# EAGLE schematic Motormix (EAGLE 9.6.2)
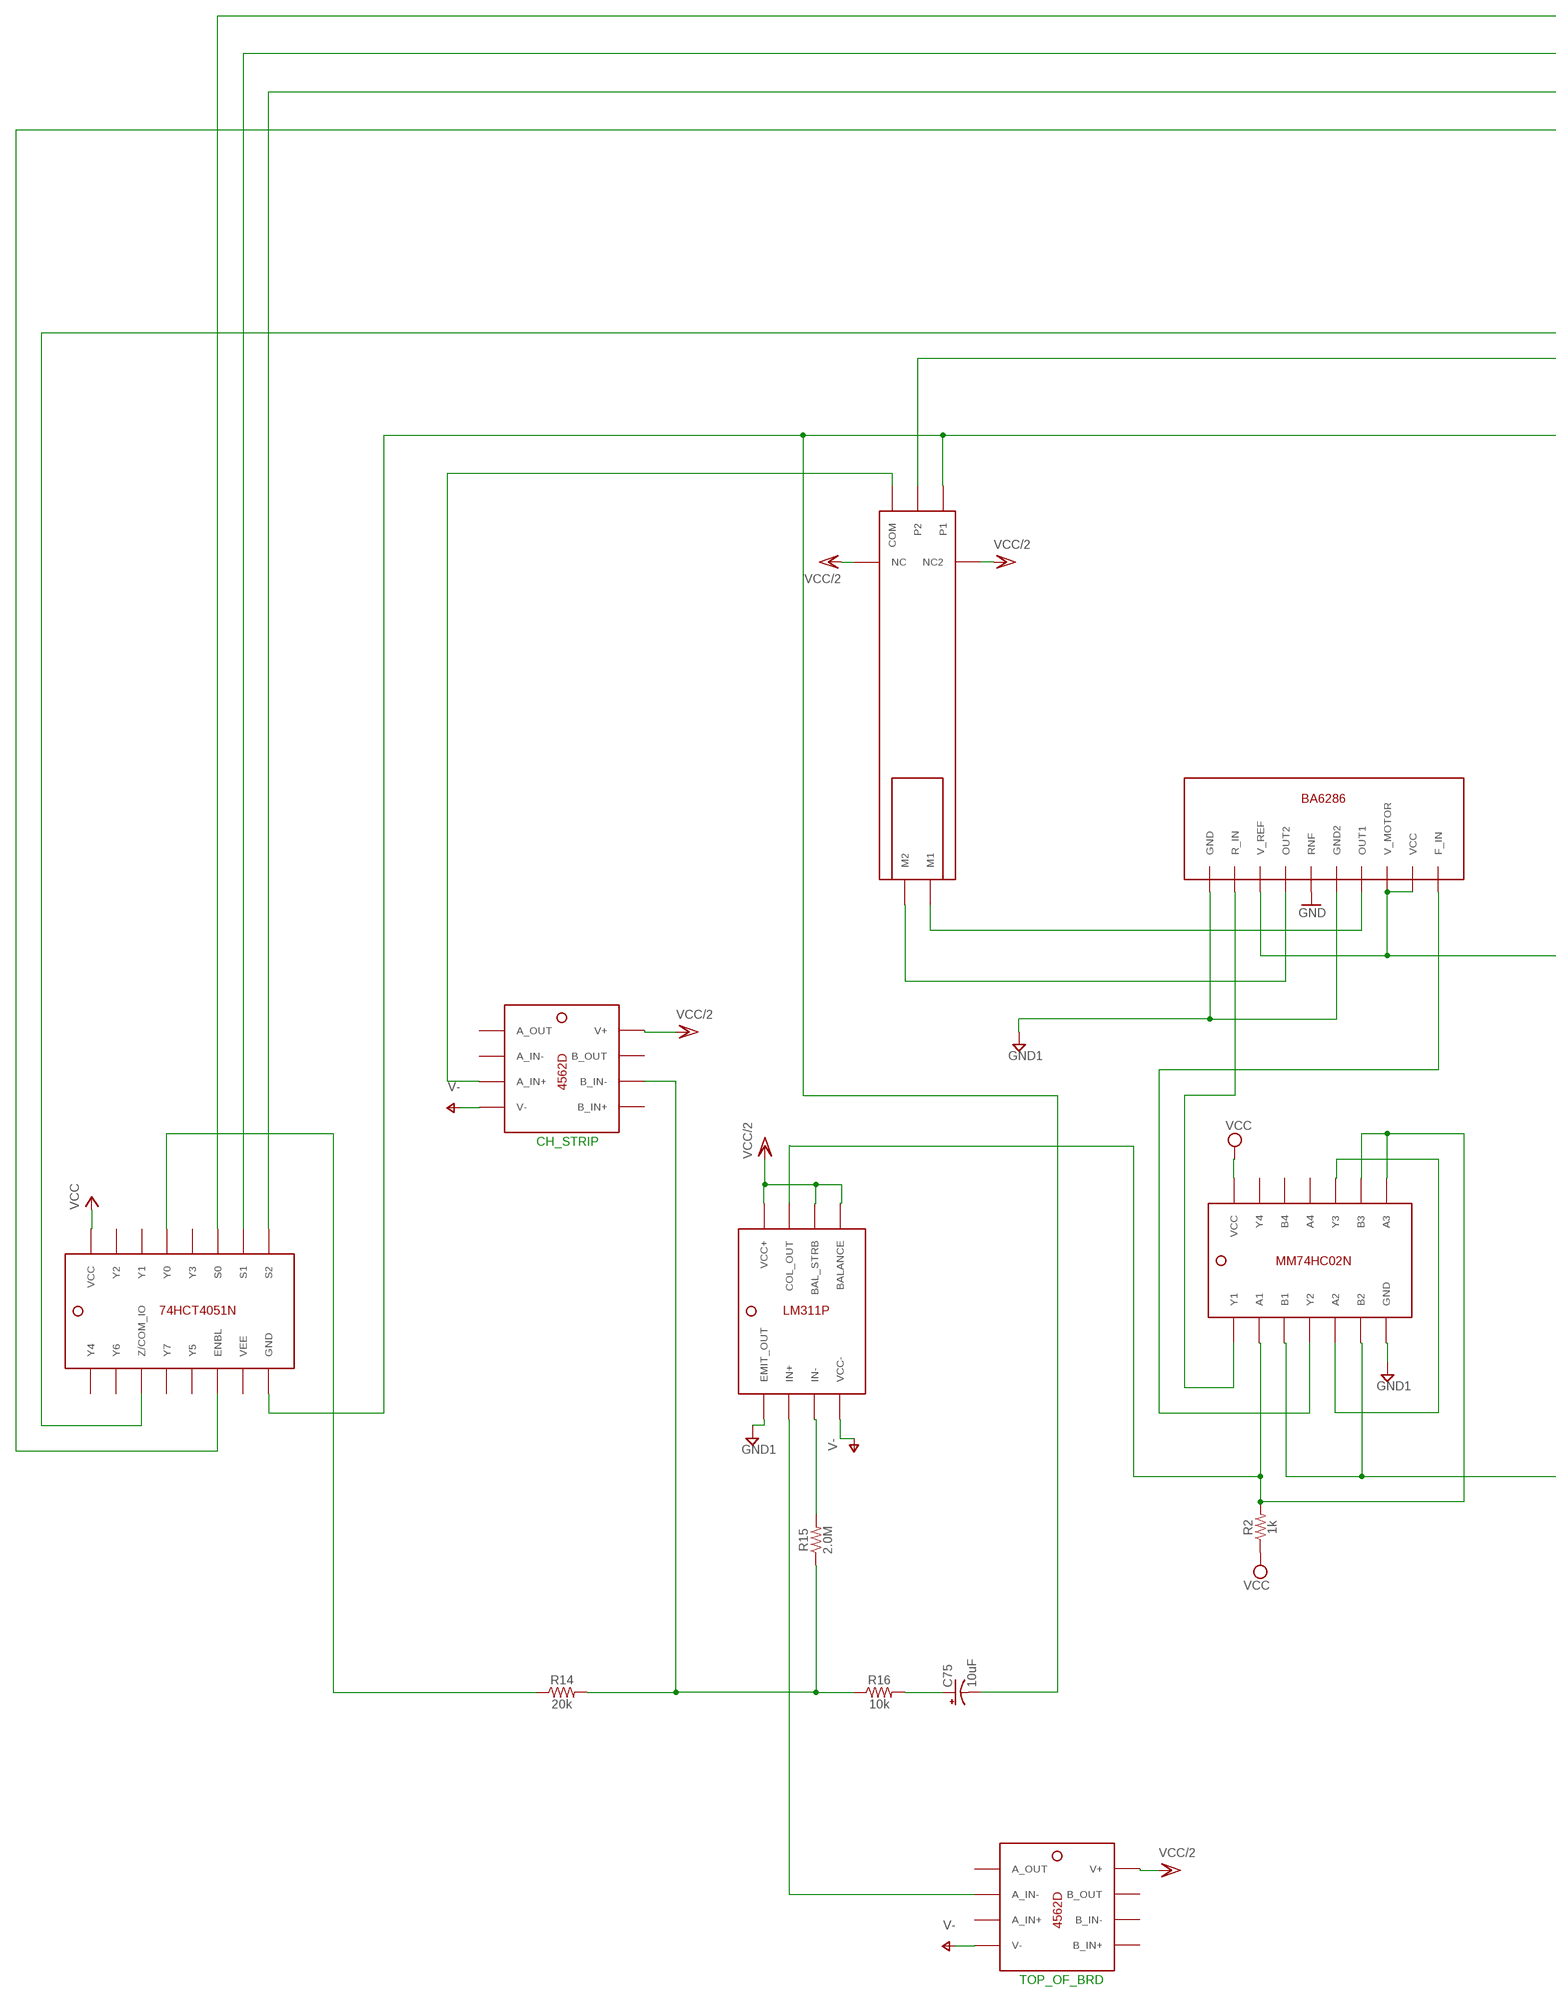
[diagram p0: schematic, sheet 1, part 1 of 2]
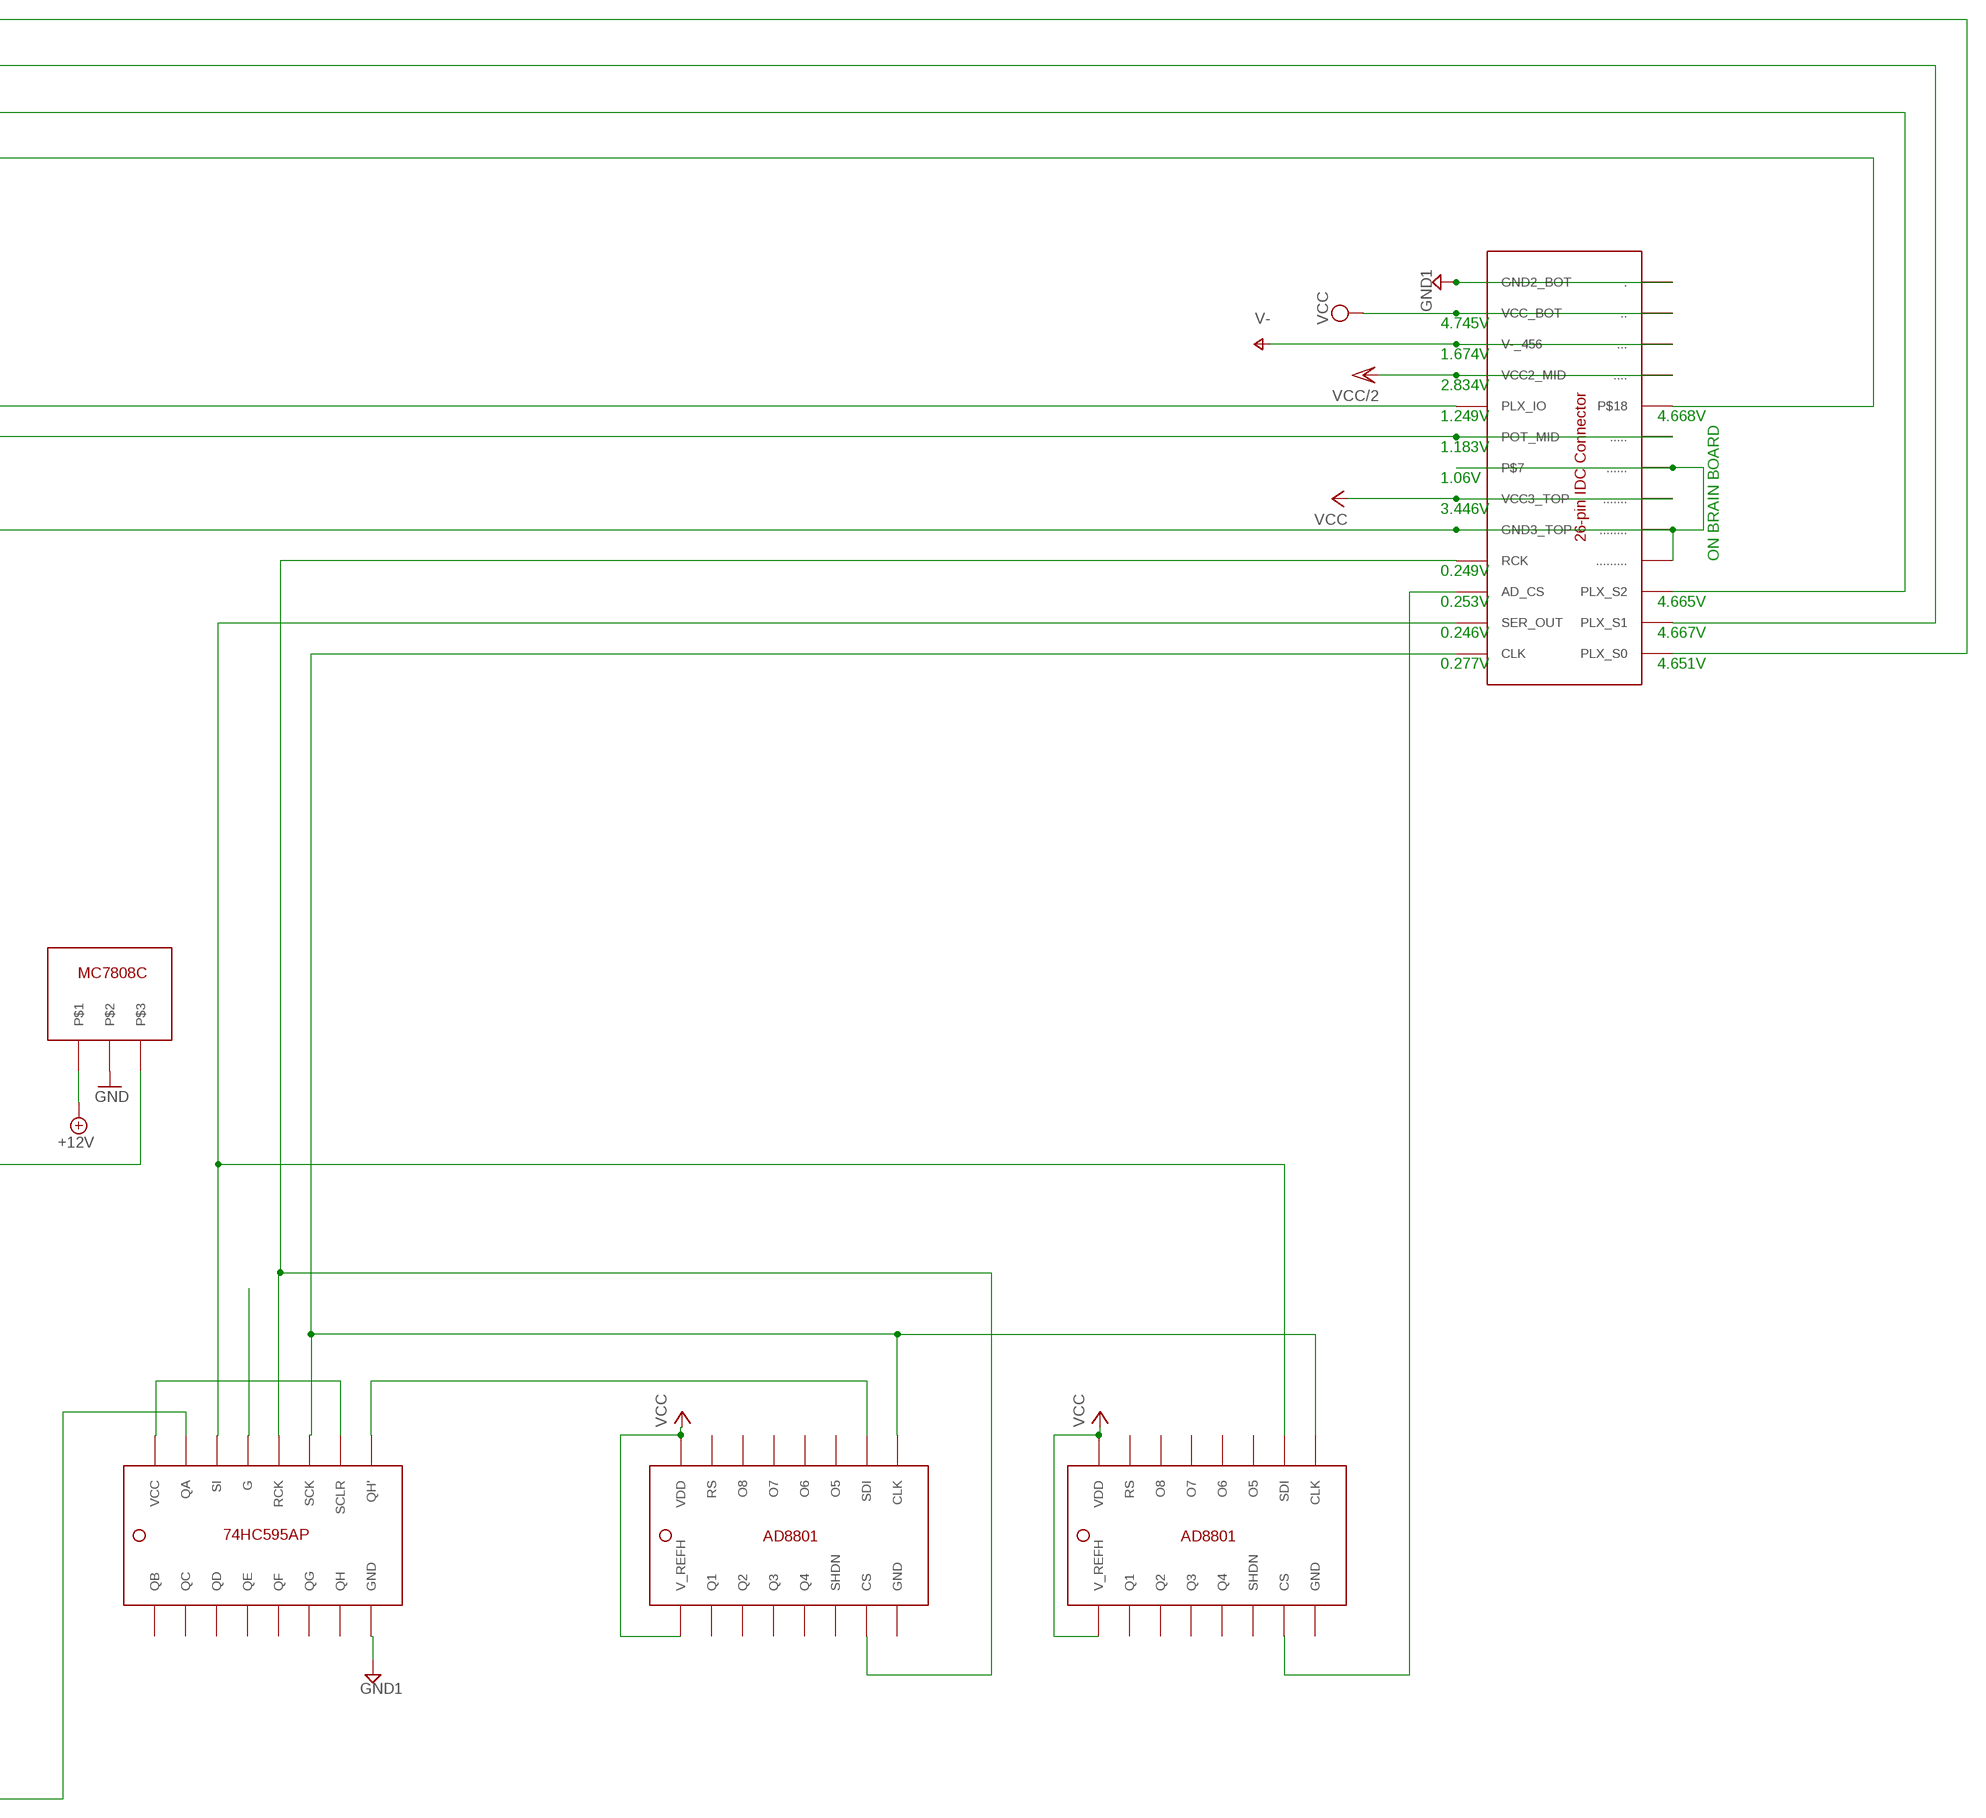
[diagram p1: schematic, sheet 1, part 2 of 2]

## Parts
C75  10uF  10UF-POLAR-RADIAL-2.5MM-25V-20%  [CPOL-RADIAL-2.5MM-5MM]
R2  1k  1KOHM-HORIZ-1/4W-1%  [AXIAL-0.3]
R14  20k  20KOHM-0603-1/10W-1%  [0603]
R15  2.0M  2MOHMS-0603-1/10W-1%  [0603]
R16  10k  10KOHM-0603-1/10W-1%  [0603]
U$1  AD8801  (no package)
U$2  MOTORISED_FADER  (no package)
U$3  BA6286  (no package)
U$4  MC7808C  (no package)
U$5  MM74HC02N  (no package)
U$6  74HC595AP  (no package)
U$7  26_PIN_IDC  (no package)
U$8  AD8801  (no package)
U$9  LM311P  (no package)
U$10  4562D  (no package)
U$11  74HCT4051N  (no package)
U$12  4562D  (no package)

## Nets
+12V: U$4.P$1
GND: U$3.RNF U$4.P$2
GND1: U$3.GND U$3.GND2 U$5.GND U$6.GND U$7.. U$7.GND2_BOT U$9.EMIT_OUT
N$1: U$2.M2 U$3.OUT2
N$2: U$2.M1 U$3.OUT1
N$3: U$3.V_MOTOR U$3.V_REF U$3.VCC U$4.P$3
N$4: U$3.F_IN U$5.Y2
N$5: U$3.R_IN U$5.Y1
N$6: U$2.COM U$10.A_IN+
N$7: U$5.A2 U$5.Y3
N$8: U$5.B1 U$5.B2 U$6.QA
N$9: R2.P$2 U$5.A1 U$5.A3 U$5.B3 U$9.COL_OUT
N$10: U$6.SCLR U$6.VCC
N$11: U$1.CLK U$6.SCK U$7.CLK
N$12: U$1.SDI U$6.QH'
N$13: U$1.CS U$6.RCK U$7.RCK
N$14: U$8.CLK
N$15: R15.2 U$9.IN-
N$16: R14.2 R15.1 R16.1 U$10.B_IN-
N$17: U$7.PLX_S2 U$11.S2
N$18: U$7.PLX_S1 U$11.S1
N$19: U$2.P2 U$7...... U$7.POT_MID
N$20: R14.1 U$11.Y0
N$21: U$7.PLX_S0 U$11.S0
N$22: U$7.PLX_IO U$11.Z/COM_IO
N$23: U$6.SI U$7.SER_OUT U$8.SDI
N$24: U$7.AD_CS U$8.CS
N$25: C75.1(+) R16.2
N$26: U$9.IN+ U$12.A_IN-
N$27: C75.2(-) U$2.P1 U$7....... U$7......... U$7.......... U$7.GND3_TOP U$7.P$7 U$11.GND
N$28: U$7.P$18 U$11.ENBL
N$29: U$6.G
V-: U$7.... U$7.V-_456 U$9.VCC- U$10.V- U$12.V-
VCC: R2.P$1 U$1.V_REFH U$1.VDD U$5.VCC U$7... U$7........ U$7.VCC3_TOP U$7.VCC_BOT U$8.V_REFH U$8.VDD U$11.VCC
VCC/2: U$2.NC U$2.NC2 U$7..... U$7.VCC2_MID U$9.BAL_STRB U$9.BALANCE U$9.VCC+ U$10.V+ U$12.V+
Unconnected: U$1.GND U$1.O5 U$1.O6 U$1.O7 U$1.O8 U$1.Q1 U$1.Q2 U$1.Q3 U$1.Q4 U$1.RS U$1.SHDN U$5.A4 U$5.B4 U$5.Y4 U$6.QB U$6.QC U$6.QD U$6.QE U$6.QF U$6.QG U$6.QH U$8.GND U$8.O5 U$8.O6 U$8.O7 U$8.O8 U$8.Q1 U$8.Q2 U$8.Q3 U$8.Q4 U$8.RS U$8.SHDN U$10.A_IN- U$10.A_OUT U$10.B_IN+ U$10.B_OUT U$11.VEE U$11.Y1 U$11.Y2 U$11.Y3 U$11.Y4 U$11.Y5 U$11.Y6 U$11.Y7 U$12.A_IN+ U$12.A_OUT U$12.B_IN+ U$12.B_IN- U$12.B_OUT

## Notes on the sheet
- 4.745V
- 1.674V
- 2.834V
- 1.249V | 4.668V
- 1.183V
- 1.06V
- 3.446V
- ON BRAIN BOARD
- 0.249V
- 0.253V | 4.665V
- 0.246V | 4.667V
- 0.277V | 4.651V
- CH_STRIP
- TOP_OF_BRD

## Library data of the parts
C75 = SparkFun-Capacitors:10UF-POLAR: 10.0µF polarized capacitors A capacitor is a passive two-terminal electrical component used to store electrical energy temporarily in an electric field.; PROD_ID: CAP-08440
R2 = SparkFun-Resistors:1KOHM: 1kΩ resistor A resistor is a passive two-terminal electrical component that implements electrical resistance as a circuit element. Resistors act to reduce current flow, and, at the same time, act to lower voltage levels within circuits. - Wikipedia; PROD_ID: RES-12182
R14 = SparkFun-Resistors:20KOHM: 20kΩ resistor A resistor is a passive two-terminal electrical component that implements electrical resistance as a circuit element. Resistors act to reduce current flow, and, at the same time, act to lower voltage levels within circuits. - Wikipedia; PROD_ID: RES-09383
R15 = SparkFun-Resistors:2MOHMS: 2MΩ resistor A resistor is a passive two-terminal electrical component that implements electrical resistance as a circuit element. Resistors act to reduce current flow, and, at the same time, act to lower voltage levels within circuits. - Wikipedia; PROD_ID: RES-10054
R16 = SparkFun-Resistors:10KOHM: 10kΩ resistor A resistor is a passive two-terminal electrical component that implements electrical resistance as a circuit element. Resistors act to reduce current flow, and, at the same time, act to lower voltage levels within circuits. - Wikipedia; PROD_ID: RES-00824
U$1 U$8 = Motormix:AD8801; _EXTERNAL_: _EXTERNAL_
U$2 = Motormix:MOTORISED_FADER; _EXTERNAL_: _EXTERNAL_
U$3 = Motormix:BA6286; _EXTERNAL_: _EXTERNAL_
U$4 = Motormix:MC7808C; _EXTERNAL_: _EXTERNAL_
U$5 = Motormix:MM74HC02N; _EXTERNAL_: _EXTERNAL_
U$6 = Motormix:74HC595AP; _EXTERNAL_: _EXTERNAL_
U$7 = Motormix:26_PIN_IDC; _EXTERNAL_: _EXTERNAL_
U$9 = Motormix:LM311P; _EXTERNAL_: _EXTERNAL_
U$10 U$12 = Motormix:4562D; _EXTERNAL_: _EXTERNAL_
U$11 = Motormix:74HCT4051N; _EXTERNAL_: _EXTERNAL_